# EasyEDA Pro project 双电源电池内阻仪.eprj, board PCB2
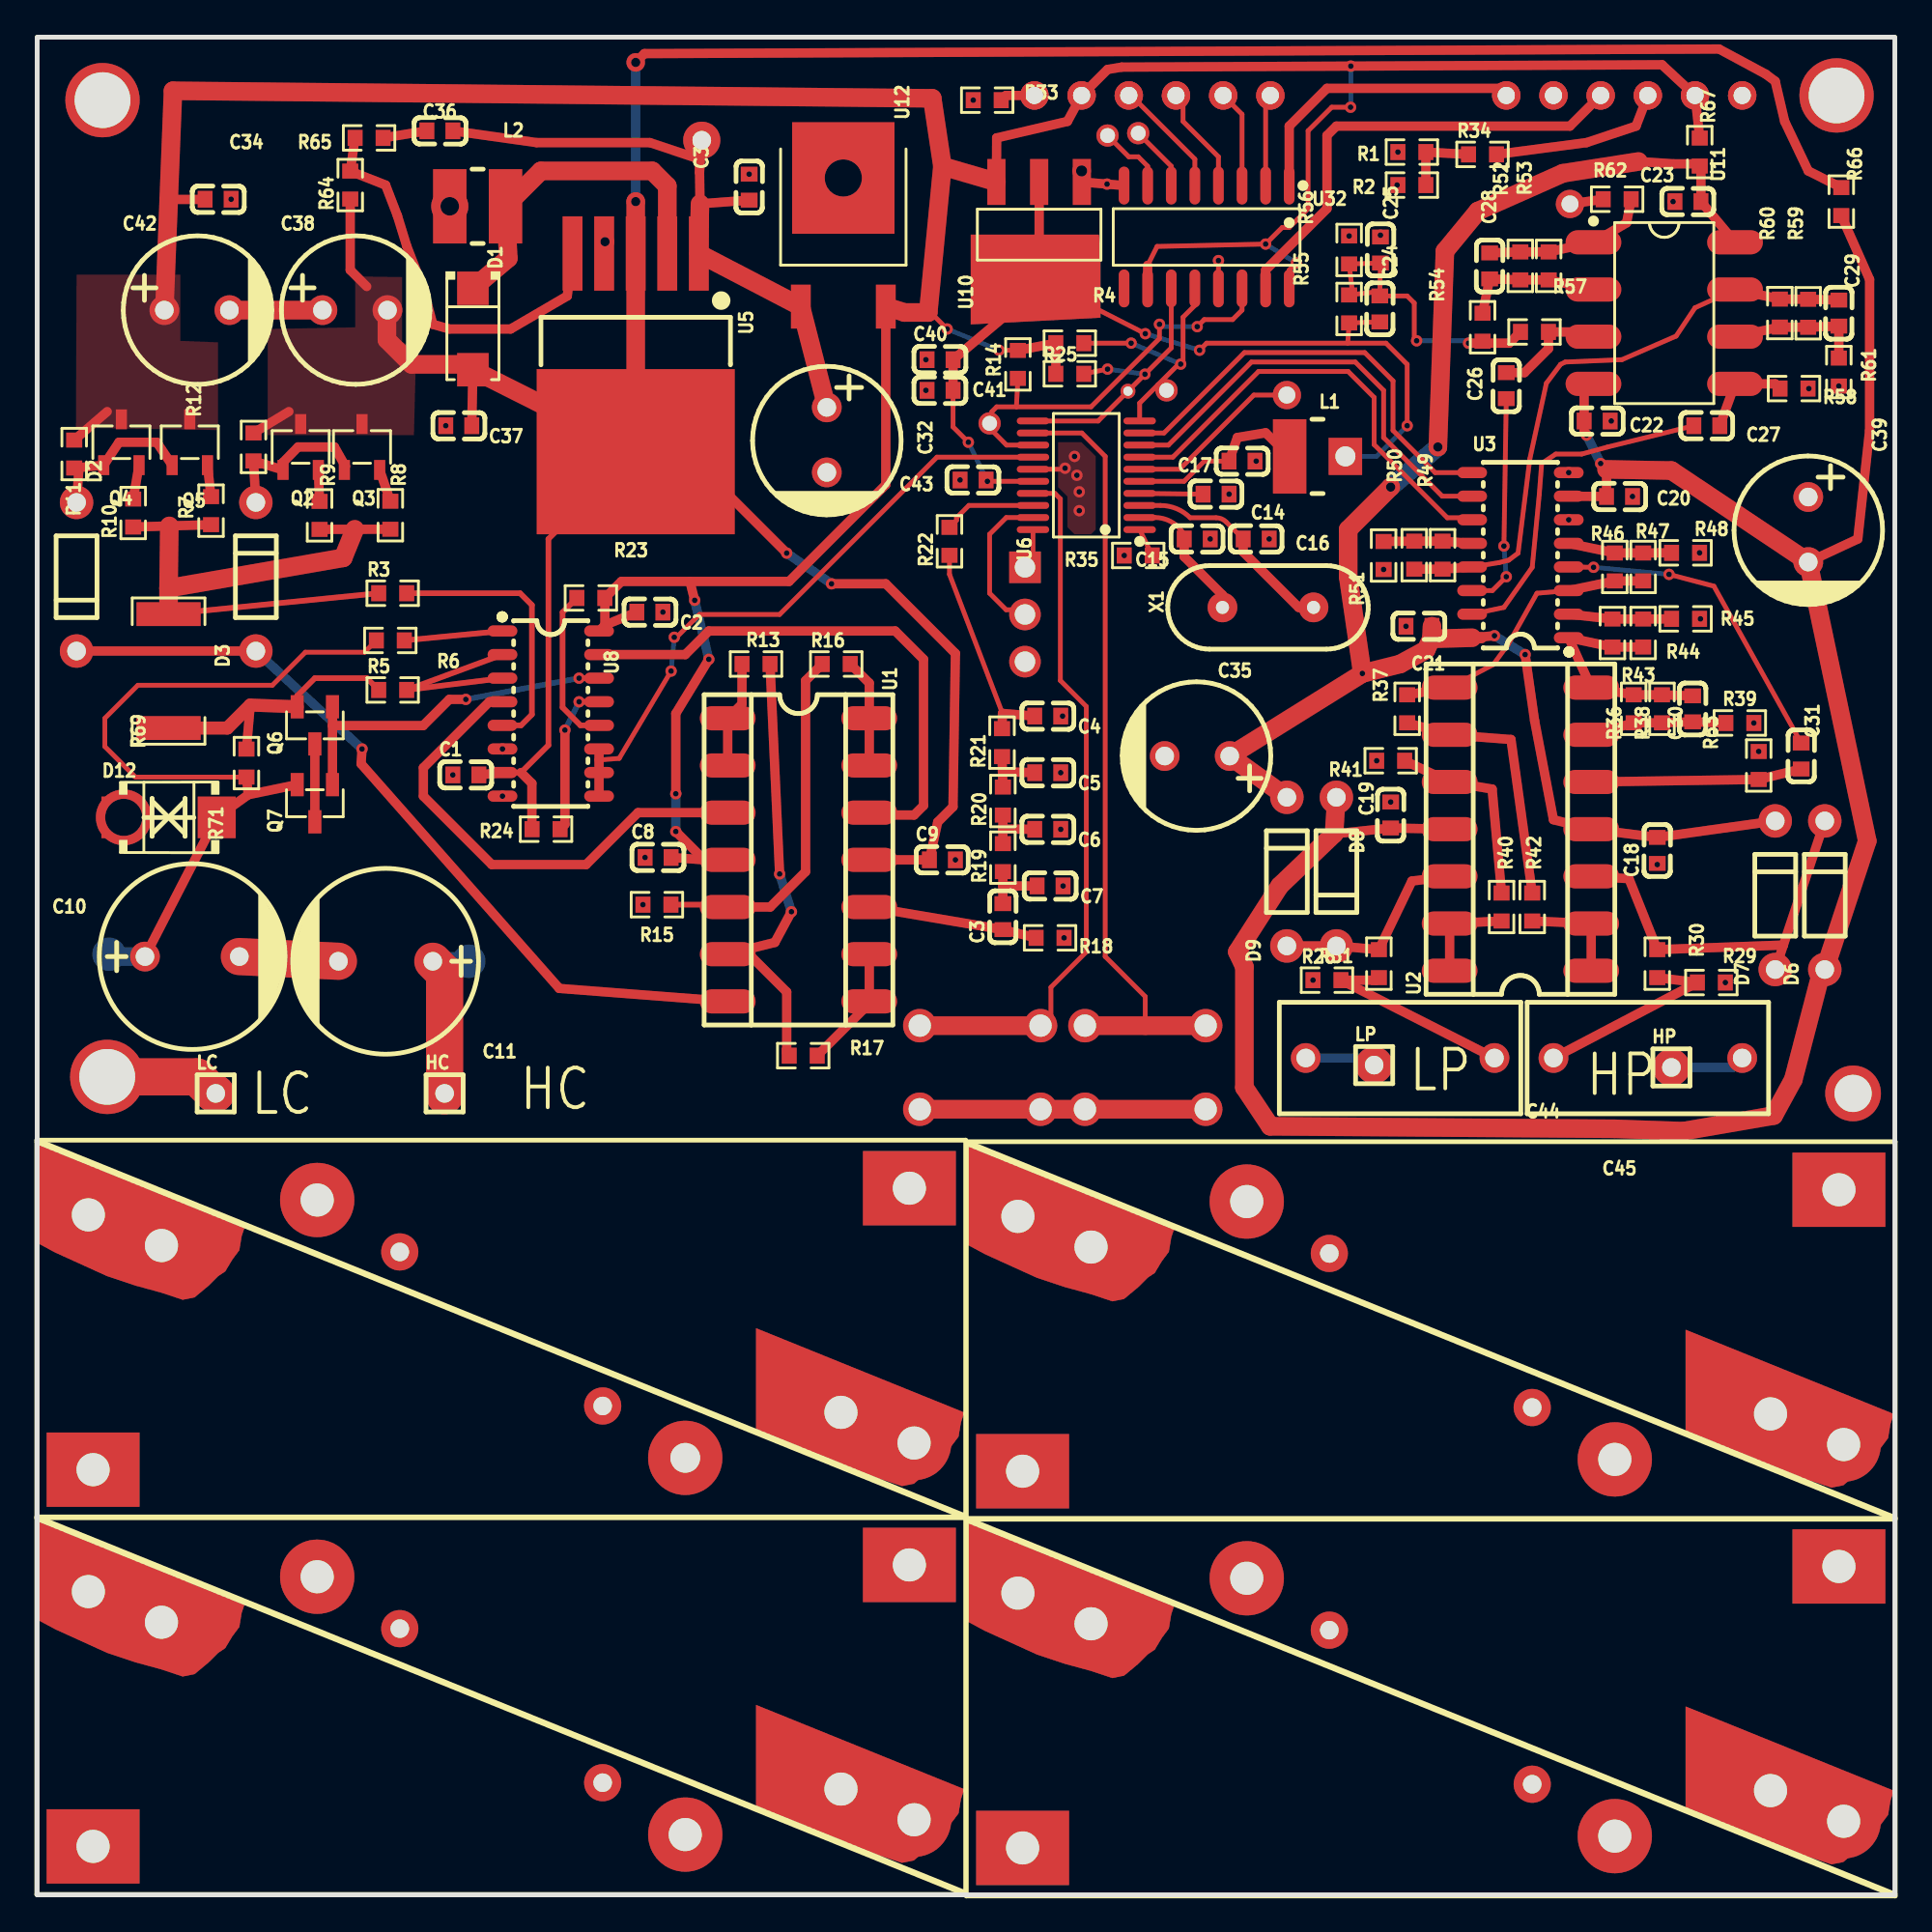
[diagram p1: board, top side]
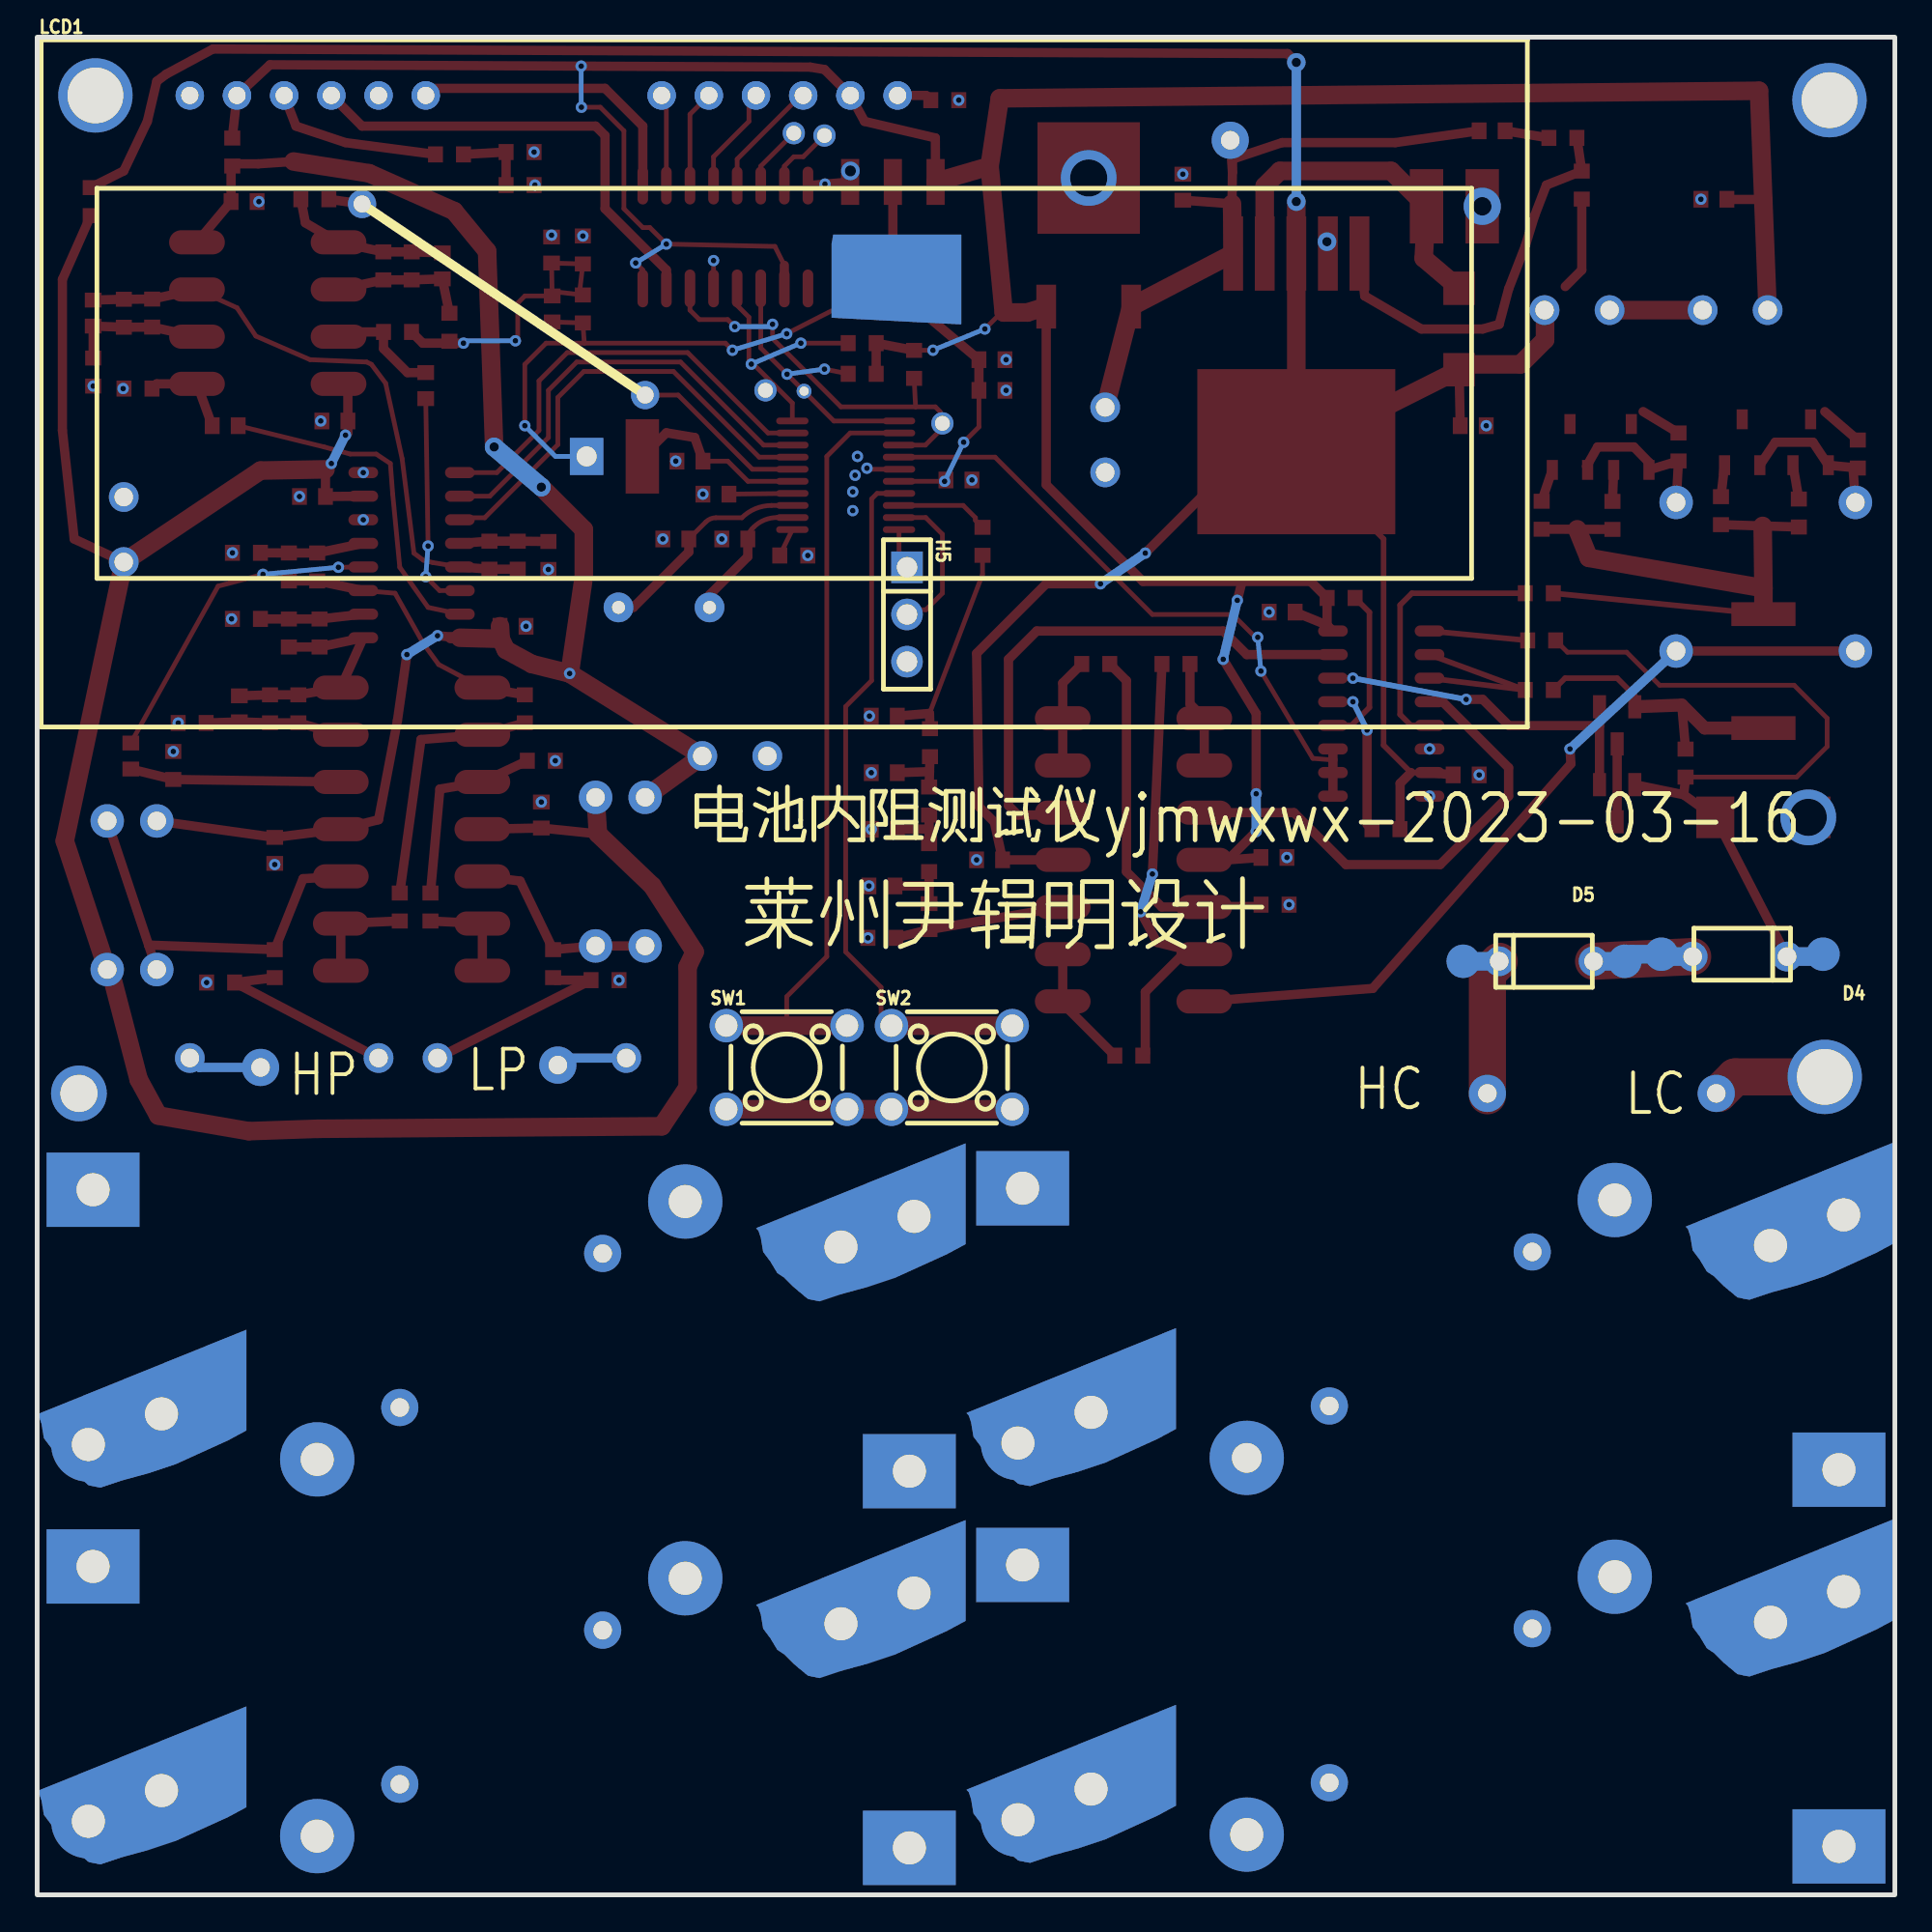
[diagram p2: board, bottom side, seen from below]

Outline 100 x 100 mm; copper layers: Top Layer, Bottom Layer. Coordinates in mm from the lower left corner of the outline.
Outline path: rectangle 0,100 100,0
Stack: Top Layer 0.035mm / Dielectric1 1.51mm FR4 er 4.5 / Bottom Layer 0.035mm

## Design rules (mm)
spacing safeClearance (default): track to track 0.152, other pairs 0.152 to 0.3
track width trackWidth (default): min 0.127, default 0.254, max 2.54
differential pair differentialPair (default): width min 0.127, default 0.254, max 2.54; gap min 0.152, default 0.152
via viaSize (default): diameter min 0.5, default 0.61, max 10; hole min 0.3, default 0.305, max 6

## Placement (name value [footprint] x y rotation side)
C1  100nF  [C0603]  23.08 60.29 0 top
C2  100nF  [C0603]  32.98 69.05 180 top
C3  10uF  [C0603]  51.99 52.66 90 top
C4  1nF  [C0603]  54.4 63.45 180 top
C5  1nF  [C0603]  54.4 60.41 180 top
C6  1nF  [C0603]  54.4 57.36 180 top
C7  500pF  [C0603]  54.53 54.31 180 top
C8  100nF  [C0603]  33.43 55.84 0 top
C9  100nF  [C0603]  48.73 55.72 0 top
C10  47uF  [CAP-TH_BD10.0-P5.00-D1.0-FD]  8.34 50.51 0 top
C11  47uF  [CAP-TH_BD10.0-P5.00-D1.0-FD]  18.76 50.25 180 top
C14  100nF  [C0603]  63.46 75.4 0 top
C15  20pF  [C0603]  62.45 72.99 0 top
C16  20pF  [C0603]  65.62 72.99 0 top
C17  10uF  [C0603]  64.86 77.18 180 top
C18  10uF  [C0603]  87.21 56.22 90 top
C19  10uF  [C0603]  72.86 58.13 90 top
C20  10uF  [C0603]  85.18 75.27 180 top
C21  10uF  [C0603]  74.38 68.29 0 top
C22  10uF  [C0603]  83.97 79.34 180 top
C23  10uF  [C0603]  88.86 91.15 0 top
C24  10uF  [C0603]  72.28 85.37 270 top
C25  10uF  [C0603]  72.31 88.54 270 top
C26  100nF  [C0603]  79.08 81.24 90 top
C27  100nF  [C0603]  89.88 79.08 0 top
C28  1nF  [C0603]  78.19 87.69 90 top
C29  1nF  [C0603]  96.98 85.15 90 top
C30  1nF  [C0603]  89.12 63.84 90 top
C31  100nF  [C0603]  94.96 61.3 270 top
C32  470uF  [CAP-TH_BD8.0-P3.50-D0.6-FD]  42.51 78.32 270 top
C33  100nF  [C0603]  38.33 91.93 270 top
C34  100nF  [C0603]  9.74 91.28 180 top
C35  470uF  [CAP-TH_BD8.0-P3.50-D0.6-FD]  62.45 61.3 180 top
C36  100nF  [C0603]  21.68 94.96 180 top
C37  100nF  [C0603]  22.69 79.08 180 top
C38  470uF  [CAP-TH_BD8.0-P3.50-D0.6-FD]  17.11 85.31 0 top
C39  470uF  [CAP-TH_BD8.0-P3.50-D0.6-FD]  95.34 73.5 270 top
C40  100nF  [C0603]  48.6 82.64 0 top
C41  10uF  [C0603]  48.6 80.99 0 top
C42  470uF  [CAP-TH_BD8.0-P3.50-D0.6-FD]  8.6 85.31 0 top
C43  10uF  [C0603]  50.38 76.16 0 top
C44  100nF  [CAP-TH_L13.0-W6.0-P10.00-D1.0]  73.37 45.05 180 top
C45  100nF  [CAP-TH_L13.0-W6.0-P10.00-D1.0]  86.7 45.05 0 top
D1  1N5819  [SMA_L4.4-W2.6-LS5.0-RD]  23.46 84.29 270 top
D2  1N4148  [DO-35_BD2.0-L4.0-P8.00-D0.5-FD]  2.12 70.95 270 top
D3  1N4148  [DO-35_BD2.0-L4.0-P8.00-D0.5-FD]  11.77 70.95 90 top
D4  -  [DO_1N4007]  8.22 50.64 0 bottom
D5  -  [DO_1N4007]  18.89 50.25 180 bottom
D6  1N4148  [DO-35_BD2.0-L4.0-P8.00-D0.5-FD]  96.23 53.81 90 top
D7  1N4148  [DO-35_BD2.0-L4.0-P8.00-D0.5-FD]  93.56 53.81 90 top
D8  1N4148  [DO-35_BD2.0-L4.0-P8.00-D0.5-FD]  69.94 55.08 270 top
D9  1N4148  [DO-35_BD2.0-L4.0-P8.00-D0.5-FD]  67.27 55.08 90 top
D12  1.0SMBJ5.0CA  [SMB_L4.6-W3.6-LS5.3-BI]  7.07 58 0 top
H5  -  [HDR-TH_3P-P2.54-V-M]  53.18 68.92 270 bottom
HC  -  [HDR-TH_1P-V-M_XKB_X4611WV-01I-C28D40]  21.93 43.14 0 top
HP  -  [HDR-TH_1P-V-M_XKB_X4611WV-01I-C28D40]  87.97 44.54 0 top
L1  47uH  [IND-SMD_L4.5-W4.0_SLF0403#2]  68.92 77.43 0 top
L2  47uH  [IND-SMD_L4.5-W4.0_SLF0403]  23.71 90.89 0 top
LC  -  [HDR-TH_1P-V-M_XKB_X4611WV-01I-C28D40]  9.61 43.14 0 top
LCD1  LCM1602K-FSW-FBW  [MODULE-TH_LCM1602K]  72.73 96.86 180 bottom
LP  -  [HDR-TH_1P-V-M_XKB_X4611WV-01I-C28D40]  71.97 44.67 0 top
NOREF  -  [Pad_e597]  46.95 38.04 0 top
NOREF#2  -  [Pad_e606]  30.44 6.04 20 top
NOREF#3  -  [Pad_e611]  47.21 4.04 160 top
NOREF#4  -  [Pad_e598]  55.66 35.4 0 top
NOREF#5  -  [Pad_e576]  69.56 14.25 200 top
NOREF#6  -  [Pad_e604]  53.05 2.53 180 top
NOREF#7  -  [Pad_e596]  47.21 24.32 160 top
NOREF#8  -  [Pad_e584]  34.89 23.52 180 top
NOREF#9  -  [Pad_e592]  2.76 36.6 340 top
NOREF#10  -  [Pad_e585]  30.44 26.32 20 top
NOREF#11  -  [Pad_e748]  86.7 96.86 0 top
NOREF#12  -  [Pad_e587]  44.34 25.45 180 top
NOREF#13  -  [Pad_e572]  94.38 5.09 180 top
NOREF#14  -  [Pad_e1653]  60.79 80.99 0 top
NOREF#15  -  [Pad_e1447]  82.51 91.02 0 top
NOREF#16  -  [Pad_e730]  58.76 96.86 0 top
NOREF#17  -  [Pad_e1654]  58.72 80.94 0 top
NOREF#18  -  [Pad_e561]  84.93 23.44 180 top
NOREF#19  -  [Pad_e566]  93.31 25.89 160 top
NOREF#20  -  [Pad_e586]  43.27 25.97 160 top
NOREF#21  -  [Pad_e573]  97.24 3.96 160 top
NOREF#22  -  [Pad_e624]  67.27 80.73 0 top
NOREF#23  -  [Pad_e732]  61.3 96.86 0 top
NOREF#24  -  [Pad_e601]  5.62 15.2 0 top
NOREF#25  -  [Pad_e746]  84.16 96.86 0 top
NOREF#26  -  [Pad_e744]  81.62 96.86 0 top
NOREF#27  -  [Pad_e615]  2.76 16.32 340 top
NOREF#28  -  [Pad_e583]  56.73 14.59 340 top
NOREF#29  -  [Pad_e582]  55.66 15.12 0 top
NOREF#30  -  [Pad_e617]  3.01 2.61 180 top
NOREF#31  -  [Pad_e363]  3.52 96.61 0 top
NOREF#32  -  [Pad_e590]  19.52 34.61 200 top
NOREF#33  -  [Pad_e593]  3.01 22.89 180 top
NOREF#34  -  [Pad_e589]  6.69 34.95 340 top
NOREF#35  -  [Pad_e588]  15.08 37.4 0 top
NOREF#36  -  [Pad_e749]  89.24 96.86 0 top
NOREF#37  -  [Pad_e612]  43.27 5.69 160 top
NOREF#38  -  [Pad_e2]  97.75 43.14 0 top
NOREF#39  -  [Pad_e741]  66.38 96.86 0 top
NOREF#40  -  [Pad_e609]  15.08 17.12 0 top
NOREF#41  -  [Pad_e578]  65.11 17.04 0 top
NOREF#42  -  [Pad_e1651]  51.27 79.21 0 top
NOREF#43  -  [Pad_e569]  96.99 37.96 0 top
NOREF#44  -  [Pad_e579]  96.99 17.68 0 top
NOREF#45  -  [Pad_e575]  80.48 5.96 20 top
NOREF#46  -  [Pad_e616]  6.69 14.67 340 top
NOREF#47  -  [Pad_e16]  35.78 94.45 0 top
NOREF#48  -  [Pad_e595]  53.05 22.81 180 top
NOREF#49  -  [Pad_e594]  52.79 16.24 340 top
NOREF#50  -  [Pad_e854]  57.62 94.7 0 top
NOREF#51  -  [Pad_e750]  91.78 96.86 0 top
NOREF#52  -  [Pad_e580]  93.31 5.61 160 top
NOREF#53  -  [Pad_e736]  63.84 96.86 0 top
NOREF#54  -  [Pad_e560]  97.24 24.24 160 top
NOREF#55  -  [Pad_e1]  3.77 44.03 0 top
NOREF#56  -  [Pad_e559]  94.38 25.37 180 top
NOREF#57  -  [Pad_e726]  53.68 96.86 0 top
NOREF#58  -  [Pad_e1670]  53.75 87.04 0 top
NOREF#59  -  [Pad_e600]  56.73 34.87 340 top
NOREF#60  -  [Pad_e562]  80.48 26.23 20 top
NOREF#61  -  [Pad_e574]  84.93 3.16 180 top
NOREF#62  -  [Pad_e564]  69.56 34.53 200 top
NOREF#63  -  [Pad_e728]  56.22 96.86 0 top
NOREF#64  -  [Pad_e613]  44.34 5.17 180 top
NOREF#65  -  [Pad_e607]  19.52 14.33 200 top
NOREF#66  -  [Pad_e605]  34.89 3.24 180 top
NOREF#67  -  [Pad_e742]  79.08 96.86 0 top
NOREF#68  -  [Pad_e599]  52.79 36.52 340 top
NOREF#69  -  [Pad_e557]  5.62 35.48 0 top
NOREF#70  -  [Pad_e610]  46.95 17.76 0 top
NOREF#71  -  [Pad_e855]  59.27 94.83 0 top
NOREF#72  -  [Pad_e365]  96.86 96.86 0 top
NOREF#73  -  [Pad_e568]  65.11 37.32 0 top
Q2  SS8550  [SOT-23-3_L2.9-W1.6-P1.90-LS2.8-BR]  14.19 77.94 270 top
Q3  SS8550  [SOT-23-3_L2.9-W1.6-P1.90-LS2.8-BR]  17.49 77.94 270 top
Q4  SS8050  [SOT-23-3_L2.9-W1.6-P1.90-LS2.8-BR]  4.53 78.19 270 top
Q5  SS8050  [SOT-23-3_L2.9-W1.6-P1.90-LS2.8-BR]  8.22 78.19 270 top
Q6  AO3400A  [SOT-23-3_L2.9-W1.3-P1.90-LS2.4-BR]  14.95 62.95 90 top
Q7  AO3400A  [SOT-23-3_L2.9-W1.3-P1.90-LS2.4-BR]  14.95 58.76 90 top
R1  1K  [R0603]  74 93.81 0 top
R2  1K  [R0603]  74 92.04 0 top
R3  1K  [R0603]  19.14 70.07 0 top
R4  500  [R0603]  55.59 83.53 180 top
R5  1K  [R0603]  19.14 64.86 0 top
R6  1K  [R0603]  19.01 67.53 0 top
R7  1  [R0603]  9.36 74.51 90 top
R8  1  [R0603]  19.01 74.27 270 top
R9  1  [R0603]  15.2 74.26 270 top
R10  1  [R0603]  5.17 74.38 90 top
R11  5K  [R0603]  1.99 77.56 90 top
R12  5K  [R0603]  11.65 77.94 270 top
R13  10K  [R0603]  38.7 66.26 180 top
R14  500  [R0603]  52.79 82.39 90 top
R15  10K  [R0603]  33.36 53.3 0 top
R16  10K  [R0603]  43.01 66.26 0 top
R17  10K  [R0603]  41.24 45.17 180 top
R18  1M  [R0603]  54.53 51.52 180 top
R19  10K  [R0603]  51.99 55.83 90 top
R20  10K  [R0603]  51.99 58.88 90 top
R21  10K  [R0603]  51.94 62.02 90 top
R22  10K  [R0603]  49.11 72.86 90 top
R23  1K  [R0603]  29.81 69.81 180 top
R24  1K  [R0603]  27.39 57.37 0 top
R25  500  [R0603]  55.59 81.88 180 top
R28  100K  [R0603]  69.43 49.24 0 top
R29  100K  [R0603]  90.12 49.11 180 top
R30  1K  [R0603]  87.21 50.13 90 top
R31  1K  [R0603]  72.22 50.13 90 top
R33  1K  [R0603]  51.14 96.61 180 top
R34  1K  [R0603]  77.8 93.69 0 top
R35  10K  [R0603]  59.27 72.1 180 top
R36  10K  [R0603]  85.94 63.84 270 top
R37  10K  [R0603]  73.75 63.84 90 top
R38  100K  [R0603]  87.47 63.84 90 top
R39  1K  [R0603]  91.66 63.08 180 top
R40  10K  [R0603]  78.83 53.17 270 top
R41  10K  [R0603]  72.86 61.05 0 top
R42  10K  [R0603]  80.48 53.17 90 top
R43  1K  [R0603]  84.8 67.92 270 top
R44  10K  [R0603]  86.45 67.92 270 top
R45  100  [R0603]  88.74 68.69 180 top
R46  1K  [R0603]  84.93 71.48 270 top
R47  10K  [R0603]  86.45 71.48 270 top
R48  100  [R0603]  88.74 72.24 180 top
R49  1K  [R0603]  74.13 72.11 270 top
R50  10K  [R0603]  75.65 72.11 270 top
R51  100  [R0603]  72.48 72.1 90 top
R52  10K  [R0603]  79.84 87.69 90 top
R53  100K  [R0603]  81.36 87.69 270 top
R54  1K  [R0603]  77.81 84.39 270 top
R55  1K  [R0603]  70.62 85.37 270 top
R56  1K  [R0603]  70.62 88.54 270 top
R57  10K  [R0603]  80.6 84.13 180 top
R58  10K  [R0603]  94.57 81.08 180 top
R59  10K  [R0603]  95.33 85.14 90 top
R60  100K  [R0603]  93.81 85.15 270 top
R61  1K  [R0603]  96.98 81.97 90 top
R62  100  [R0603]  85.05 91.28 180 top
R63  10K  [R0603]  92.67 60.8 270 top
R64  100K  [R0603]  16.85 92.04 90 top
R65  100K  [R0603]  17.87 94.58 180 top
R66  10  [R0603]  97.12 91.15 270 top
R67  10  [R0603]  89.5 93.81 270 top
R69  10Ω  [R2512]  7.07 65.88 90 top
R71  100Ω  [R0603]  11.27 60.92 90 top
SW1  1TS005A-2600-5001  [SW-TH_4P-L6.0-W6.0-P4.50-LS6.5]  59.65 44.54 180 bottom
SW2  1TS005A-2600-5001  [SW-TH_4P-L6.0-W6.0-P4.50-LS6.5]  50.76 44.54 180 bottom
U1  TL084CN  [DIP-14_L17.8-W10.2-P2.54-BL]  40.98 55.72 270 top
U2  TL084CN  [DIP-14_L17.8-W10.2-P2.54-BL]  79.84 57.37 90 top
U3  CD4053BM/TR  [SOP-16_L9.9-W3.9-P1.27-LS6.1-BL]  79.84 72.11 90 top
U5  XL2596S-5.0E1  [TO-263-5_L10.2-W9.9-P1.70-LS14.4-TL]  32.22 83.02 270 top
U6  STM32F030F4P6  [TSSOP-20_L6.5-W4.4-P0.65-LS6.4-BL]  56.48 76.42 90 top
U8  CD4053BM/TR  [SOP-16_L9.9-W3.9-P1.27-LS6.1-BL]  27.65 63.59 270 top
U10  AMS1117-3.3  [SOT-223-4_L6.5-W3.5-P2.30-LS7.0-BR]  53.94 89.37 90 top
U11  NE5532P  [DIP-8_L9.4-W6.4-P2.54-LS9.1-BL]  87.59 85.15 270 top
U12  CJ7805 3%  [TO-252-2_L6.6-W6.1-P4.58-LS10.1-BR-CW]  43.4 88.96 270 top
U32  74HC595D.  [SOP-16_L9.9-W3.9-P1.27-LS6.0-BL]  62.95 89.24 180 top
X1  8MHz  [OSC-TH_L10.0-W4.5-P5.00]  66.26 69.3 90 top

## Footprints (pads in the part's own frame, mm; a bottom-side part is the same pattern mirrored in y, then rotated)
C0603
  rect 0.8x0.9 smd: 1(-0.7,0) 2(0.7,0)
CAP-TH_BD8.0-P3.50-D0.6-FD
  round 1.6 hole 1: 1(-1.75,0) 2(1.75,0)
CAP-TH_BD10.0-P5.00-D1.0-FD
  round 1.6 hole 1: 1(-2.54,0) 2(2.54,0)
CAP-TH_L13.0-W6.0-P10.00-D1.0
  round 1.6 hole 1: 1(-5.08,0) 2(5.08,0)
DIP-8_L9.4-W6.4-P2.54-LS9.1-BL
  oval 1.3x3 smd: 1(-3.81,-3.81) 2(-1.27,-3.81) 3(1.27,-3.81) 4(3.81,-3.81) 5(3.81,3.81) 6(1.27,3.81) 7(-1.27,3.81) 8(-3.81,3.81)
DIP-14_L17.8-W10.2-P2.54-BL
  oval 1.3x3 smd: 1(-7.62,-3.81) 2(-5.08,-3.81) 3(-2.54,-3.81) 4(0,-3.81) 5(2.54,-3.81) 6(5.08,-3.81) 7(7.62,-3.81) 8(7.62,3.81) 9(5.08,3.81) 10(2.54,3.81) 11(0,3.81) 12(-2.54,3.81) 13(-5.08,3.81) 14(-7.62,3.81)
DO-35_BD2.0-L4.0-P8.00-D0.5-FD
  round 1.8 hole 1: 1(-4,0) 2(4,0)
DO_1N4007
  round 1.8 smd: 1(-4.35,0) 2(4.35,0)
HDR-TH_1P-V-M_XKB_X4611WV-01I-C28D40
  round 2 hole 1: 1(0,0)
HDR-TH_3P-P2.54-V-M
  rect 1.7x1.7 hole 1.1: 1(-2.54,0)
  round 1.7 hole 1.1: 2(0,0) 3(2.54,0)
IND-SMD_L4.5-W4.0_SLF0403
  rect 1.8x4 smd: 1(-1.5,0) 2(1.5,0)
IND-SMD_L4.5-W4.0_SLF0403#2
  rect 1.8x4 smd: 1(-1.5,0)
  rect 1.8x2 hole 1.08: 2(1.5,0)
MODULE-TH_LCM1602K
  round 1.524 hole 0.914: 1(-19.05,0) 2(-16.51,0) 3(-13.97,0) 4(-11.43,0) 5(-8.89,0) 6(-6.35,0) 11(6.35,0) 12(8.89,0) 13(11.43,0) 14(13.97,0) 15(16.51,0) 16(19.05,0)
OSC-TH_L10.0-W4.5-P5.00
  round 1.6 hole 0.7: 1(0,2.45) 2(0,-2.45)
Pad_e1
  round 4 hole 3: 1(0,0)
Pad_e2
  round 3 hole 2: 1(0,0)
Pad_e16
  round 2 hole 1: 1(0,0)
Pad_e363
  round 4 hole 3: 1(0,0)
Pad_e365
  round 4 hole 3: 1(0,0)
Pad_e557
  custom 11.284x8.504 hole 0.005: 1(0,0)
Pad_e559
  custom 11.284x8.504 hole 0.005: 1(0,0)
Pad_e560
  oval 4x4 hole 1.78: 1(0,0)
Pad_e561
  round 4 hole 1.78: 1(0,0)
Pad_e562
  round 2 hole 1: 1(0,0)
Pad_e564
  round 2 hole 1: 1(0,0)
Pad_e566
  oval 4x4 hole 1.78: 1(0,0)
Pad_e568
  round 4 hole 1.78: 1(0,0)
Pad_e569
  rect 5x4 hole 1.78: 1(0,0)
Pad_e572
  custom 11.284x8.504 hole 0.005: 1(0,0)
Pad_e573
  oval 4x4 hole 1.78: 1(0,0)
Pad_e574
  round 4 hole 1.78: 1(0,0)
Pad_e575
  round 2 hole 1: 1(0,0)
Pad_e576
  round 2 hole 1: 1(0,0)
Pad_e578
  round 4 hole 1.78: 1(0,0)
Pad_e579
  rect 5x4 hole 1.78: 1(0,0)
Pad_e580
  oval 4x4 hole 1.78: 1(0,0)
Pad_e582
  custom 11.284x8.504 hole 0.005: 1(0,0)
Pad_e583
  oval 4x4 hole 1.78: 1(0,0)
Pad_e584
  round 4 hole 1.6: 1(0,0)
Pad_e585
  round 2 hole 1: 1(0,0)
Pad_e586
  oval 4x4 hole 1.78: 1(0,0)
Pad_e587
  custom 11.284x8.504 hole 0.005: 1(0,0)
Pad_e588
  round 4 hole 1.78: 1(0,0)
Pad_e589
  oval 4x4 hole 1.78: 1(0,0)
Pad_e590
  round 2 hole 1: 1(0,0)
Pad_e592
  oval 4x4 hole 1.78: 1(0,0)
Pad_e593
  rect 5x4 hole 1.78: 1(0,0)
Pad_e594
  oval 4x4 hole 1.78: 1(0,0)
Pad_e595
  rect 5x4 hole 1.78: 1(0,0)
Pad_e596
  oval 4x4 hole 1.78: 1(0,0)
Pad_e597
  rect 5x4 hole 1.78: 1(0,0)
Pad_e598
  custom 11.284x8.504 hole 0.005: 1(0,0)
Pad_e599
  oval 4x4 hole 1.78: 1(0,0)
Pad_e600
  oval 4x4 hole 1.78: 1(0,0)
Pad_e601
  custom 11.284x8.504 hole 0.005: 1(0,0)
Pad_e604
  rect 5x4 hole 1.78: 1(0,0)
Pad_e605
  round 4 hole 1.78: 1(0,0)
Pad_e606
  round 2 hole 1: 1(0,0)
Pad_e607
  round 2 hole 1: 1(0,0)
Pad_e609
  round 4 hole 1.78: 1(0,0)
Pad_e610
  rect 5x4 hole 1.78: 1(0,0)
Pad_e611
  oval 4x4 hole 1.78: 1(0,0)
Pad_e612
  oval 4x4 hole 1.78: 1(0,0)
Pad_e613
  custom 11.284x8.504 hole 0.005: 1(0,0)
Pad_e615
  oval 4x4 hole 1.78: 1(0,0)
Pad_e616
  oval 4x4 hole 1.78: 1(0,0)
Pad_e617
  rect 5x4 hole 1.78: 1(0,0)
Pad_e624
  round 1.524 hole 0.914: 1(0,0)
Pad_e726
  round 1.524 hole 0.914: 2(0,0)
Pad_e728
  round 1.524 hole 0.914: 3(0,0)
Pad_e730
  round 1.524 hole 0.914: 4(0,0)
Pad_e732
  round 1.524 hole 0.914: 5(0,0)
Pad_e736
  round 1.524 hole 0.914: 6(0,0)
Pad_e741
  round 1.524 hole 0.914: 7(0,0)
Pad_e742
  round 1.524 hole 0.914: 8(0,0)
Pad_e744
  round 1.524 hole 0.914: 9(0,0)
Pad_e746
  round 1.524 hole 0.914: 10(0,0)
Pad_e748
  round 1.524 hole 0.914: 11(0,0)
Pad_e749
  round 1.524 hole 0.914: 12(0,0)
Pad_e750
  round 1.524 hole 0.914: 13(0,0)
Pad_e854
  round 1.2 hole 0.8: 1(0,0)
Pad_e855
  round 1.2 hole 0.8: 14(0,0)
Pad_e1447
  round 1.524 hole 0.914: 1(0,0)
Pad_e1651
  round 1.2 hole 0.8: 1(0,0)
Pad_e1653
  round 1.2 hole 0.8: 15(0,0)
Pad_e1654
  round 0.8 hole 0.5: 16(0,0)
Pad_e1670
  custom 6.985x4.832 hole 2.791: 17(0,0)
R0603
  rect 0.806x0.864 smd: 1(-0.753,0) 2(0.753,0)
R2512
  rect 1.282x3.456 smd: 1(-3.067,0) 2(3.067,0)
SMA_L4.4-W2.6-LS5.0-RD
  rect 1.8x1.7 smd: 1(-2.192,0) 2(2.192,0)
SMB_L4.6-W3.6-LS5.3-BI
  rect 2.047x2.241 smd: 1(-2.591,0) 2(2.591,0)
SOP-16_L9.9-W3.9-P1.27-LS6.0-BL
  oval 0.574x2.038 smd: 1(-4.445,-2.769) 2(-3.175,-2.769) 3(-1.905,-2.769) 4(-0.635,-2.769) 5(0.635,-2.769) 6(1.905,-2.769) 7(3.175,-2.769) 8(4.445,-2.769) 9(4.445,2.769) 10(3.175,2.769) 11(1.905,2.769) 12(0.635,2.769) 13(-0.635,2.769) 14(-1.905,2.769) 15(-3.175,2.769) 16(-4.445,2.769)
SOP-16_L9.9-W3.9-P1.27-LS6.1-BL
  oval 0.6x1.6 smd: 1(-4.445,-2.6) 2(-3.175,-2.6) 3(-1.905,-2.6) 4(-0.635,-2.6) 5(0.635,-2.6) 6(1.905,-2.6) 7(3.175,-2.6) 8(4.445,-2.6) 9(4.445,2.6) 10(3.175,2.6) 11(1.905,2.6) 12(0.635,2.6) 13(-0.635,2.6) 14(-1.905,2.6) 15(-3.175,2.6) 16(-4.445,2.6)
SOT-23-3_L2.9-W1.3-P1.90-LS2.4-BR
  rect 1.25x0.7 smd: 1(1,-0.95) 2(1,0.95) 3(-1,0)
SOT-23-3_L2.9-W1.6-P1.90-LS2.8-BR
  rect 1.07x0.6 smd: 1(1.235,-0.95) 2(1.235,0.95) 3(-1.235,0)
SOT-223-4_L6.5-W3.5-P2.30-LS7.0-BR
  rect 2.47x0.98 smd: 1(2.835,-2.3) 2(2.835,0) 3(2.835,2.3)
  rect 2.47x3.6 smd: 4(-2.835,0)
SW-TH_4P-L6.0-W6.0-P4.50-LS6.5
  round 1.8 hole 1.2: 1(-3.25,2.25) 2(3.25,2.25) 3(-3.25,-2.25) 4(3.25,-2.25)
TO-252-2_L6.6-W6.1-P4.58-LS10.1-BR-CW
  rect 2.364x1.064 smd: 1(3.462,-2.286) 3(3.462,2.286)
  rect 6.004x5.512 smd: 2(-3.462,0)
TO-263-5_L10.2-W9.9-P1.70-LS14.4-TL
  rect 4x1.069 smd: 1(-5.334,3.4) 2(-5.334,1.7) 3(-5.334,0) 4(-5.334,-1.7) 5(-5.334,-3.4)
  rect 8.89x10.66 smd: 6(5.334,0)
TSSOP-20_L6.5-W4.4-P0.65-LS6.4-BL
  oval 0.364x1.742 smd: 1(-2.925,-2.871) 2(-2.275,-2.871) 3(-1.625,-2.871) 4(-0.975,-2.871) 5(-0.325,-2.871) 6(0.325,-2.871) 7(0.975,-2.871) 8(1.625,-2.871) 9(2.275,-2.871) 10(2.925,-2.871) 11(2.925,2.871) 12(2.275,2.871) 13(1.625,2.871) 14(0.975,2.871) 15(0.325,2.871) 16(-0.325,2.871) 17(-0.975,2.871) 18(-1.625,2.871) 19(-2.275,2.871) 20(-2.925,2.871)

## Nets
As in the schematic, except:
+3.3V: C24.2 C40.2 C41.2 C43.2 L1.2 NOREF#58.17 R55.2 U6.16 U10.2 U10.4
+5V-D: C2.2 C8.2 C34.2 C42.1 LCD1.2 LCD1.15 NOREF#36.12 NOREF#63.3 Q4.3 Q5.3 R4.2 R11.2 R14.2 R23.1 R25.2 R67.1 U1.4 U8.16 U10.3 U12.3 U32.10 U32.16
GND: C1.1 C2.1 C4.1 C5.1 C6.1 C7.1 C8.1 C9.2 C14.2 C15.2 C16.2 C17.1 C18.1 C19.2 C20.1 C21.1 C22.1 C23.1 C25.1 C32.2 C33.1 C34.1 C35.2 C37.2 C38.1 C39.1 C40.1 C41.1 C42.2 C43.1 D12.1 H5.3 L2.1 LC.1 LCD1.1 LCD1.5 NOREF.1 NOREF#2.1 NOREF#5.1 NOREF#6.1 NOREF#8.1 NOREF#10.1 NOREF#18.1 NOREF#26.9 NOREF#30.1 NOREF#31.1 NOREF#32.1 NOREF#33.1 NOREF#35.1 NOREF#38.1 NOREF#40.1 NOREF#41.1 NOREF#43.1 NOREF#44.1 NOREF#45.1 NOREF#48.1 NOREF#51.13 NOREF#55.1 NOREF#60.1 NOREF#61.1 NOREF#62.1 NOREF#65.1 NOREF#66.1 NOREF#70.1 NOREF#72.1 NOREF#73.1 R1.1 R2.1 R15.1 R18.1 R28.1 R29.1 R33.2 R35.2 R39.1 R41.1 R45.1 R48.1 R51.1 R56.1 R58.1 R61.1 R63.1 SW1.3 SW1.4 SW2.3 SW2.4 U3.6 U3.8 U5.4 U6.15 U8.6 U8.8 U10.1 U12.2 U32.8 U32.13
+9: C32.1 C33.2 C36.1 NOREF#47.1 U5.1 U12.1
PA0_ADC: NOREF#15.1 NOREF#22.1 R62.2 U6.6
PA4_SPI1_NSS_HC595_12_RCK: NOREF#14.15 R4.1 U6.10 U32.12
PA5_SPI1_SCK_HC595_11_SCK: NOREF#17.16 R25.1 U6.11 U32.11
PA7_SPI1_MOSI_HC595_14_SER: NOREF#42.1 R14.1 U6.13 U32.14
$1N32014: LCD1.16 NOREF#57.2 R33.1
$1N33242: LCD1.11 NOREF#39.7 U32.2
$1N33289: LCD1.12 NOREF#53.6 U32.3
$1N33336: LCD1.13 NOREF#23.5 U32.4
$1N33383: LCD1.14 NOREF#16.4 U32.5
$1N33961: LCD1.6 NOREF#67.8 U32.1
$1N34010: LCD1.4 NOREF#25.10 U32.15
$1N34377: LCD1.3 NOREF#11.11 R34.2

Pads without a net: NOREF#3 1; NOREF#4 1; NOREF#7 1; NOREF#9 1; NOREF#12 1; NOREF#13 1; NOREF#19 1; NOREF#20 1; NOREF#21 1; NOREF#24 1; NOREF#27 1; NOREF#28 1; NOREF#29 1; NOREF#34 1; NOREF#37 1; NOREF#46 1; NOREF#49 1; NOREF#50 1; NOREF#52 1; NOREF#54 1; NOREF#56 1; NOREF#59 1; NOREF#64 1; NOREF#68 1; NOREF#69 1; NOREF#71 14; U32 6 7 9

## Via types
v1: diameter 0.61, hole 0.305, Top Layer to Bottom Layer, 96 vias
v2: diameter 1, hole 0.5, Top Layer to Bottom Layer, 5 vias
v3: diameter 3, hole 2, Top Layer to Bottom Layer, 2 vias
v4: diameter 1, hole 0.6, Top Layer to Bottom Layer, 1 via
v5: diameter 2, hole 1, Top Layer to Bottom Layer, 1 via

## Routing (per net, layer and track width the routed paths; a pad name or vN(x,y) marks a point on that pad's centre or on a via; arc(x,y) is an arc through that point)
+3.3V: length 51.4
  Top Layer w0.254: 70.55,83.53 72.61,83.53 73.75,82.39 v1(73.75,79.08) ; 70.55,83.53 R55.2 C24.2 ; 70.55,83.53 62.95,83.53 v1(62.57,83.15) ; v1(59.65,84.04) NOREF#58.17 ; C43.2 v1(51.15,76.09) U6.16 ; v1(50.13,78.19) 49.3,79.02 C41.2
  Top Layer w0.5: C41.2 C40.2 U10.4 ; U10.2 53.94,88.1
  Bottom Layer w0.254: v1(73.75,79.08) 72.1,77.43 L1.2 ; v1(62.57,83.15) v1(59.65,84.04) ; v1(50.13,78.19) v1(51.15,76.09)
+5V: length 88.6
  Top Layer w0.5: v1(80.1,66.76) 80.61,63.21 81.62,57.87 U2.4 C18.2 D7.2 ; v1(78.45,67.78) U3.16 ; 86.19,93.31 88.1,93.18 89.24,93.18 89.56,92.86 C23.2 91.4,88.96
  Top Layer w1: 75.05,67.61 C21.2 ; 75.05,67.61 74.76,67.02 73.37,66.26 v1(71.34,65.75) ; 75.05,67.61 U3.16 ; v1(71.34,65.75) C35.1 D9.2 ; v1(71.34,65.75) 70.57,70.95 70.57,73.5 v2(72.86,75.78) ; 86.19,93.31 82.13,92.67 77.56,90.64 75.78,88.48 v2(75.4,77.94)
  Bottom Layer w0.5: v1(80.1,66.76) v1(78.45,67.78)
  Bottom Layer w1: v2(72.86,75.78) v2(75.4,77.94)
+5V-D: length 201.7
  Top Layer w0.254: v1(70.7,96.23) 69.69,96.23 68.41,94.96 68.41,90.77 67.4,89.75 67.02,89.75 v1(66.13,88.86) 60.29,88.73 59.78,87.72 ; v1(51.78,83.15) 52.79,83.15 R14.2 ; U32.16 67.4,87.47 v1(67.78,87.85) ; v1(48.98,84.29) 48.09,85.18
  Top Layer w0.5: 30.56,68.35 C2.2 ; 30.56,68.35 U8.16 ; 30.56,68.35 R23.1 31.45,70.7 35.14,70.7 ; C8.2 35.9,55.72 ; 35.9,55.72 U1.4 ; 35.9,55.72 v1(34.38,57.24) ; U32.10 59.78,87.72 ; v1(36.16,66.51) 34.38,63.59 v1(34.38,59.27) ; U10.3 51.65,94.58 55.46,95.47 NOREF#63.3 57.62,98.26 58.38,98.39 v1(70.72,98.44) 87.47,98.51 NOREF#36.12 R67.1 ; R14.2 R4.2 R25.2 ; 7.08,91.26 9.03,91.26 C34.2 ; v1(35.4,69.69) 35.14,70.7 ; 35.14,70.7 40.47,70.7 45.68,75.91 U12.3 ; R11.2 3.77,79.84
  Top Layer w1: 48.73,93.05 U10.3 ; 48.73,93.05 47.97,85.18 46.7,85.18 U12.3 ; 48.73,93.05 48.18,96.71 7.31,97.11 7.08,91.26 C42.1
  Bottom Layer w0.254: v1(67.78,87.85) v1(66.13,88.86) ; v1(51.78,83.15) v1(48.98,84.29) ; v1(70.7,96.23) 70.72,96.24 v1(70.72,98.44)
  Bottom Layer w0.5: v1(35.4,69.69) v1(36.16,66.51) ; v1(34.38,59.27) v1(34.38,57.24)
-5V: length 126.3
  Top Layer w0.5: v1(83.4,78.58) 83.27,78.7 C22.2 83.27,80.83 U11.4 ; C39.2 98.01,72.99 98.64,78.83 98.64,86.96 R66.2 ; 69.81,57.11 C19.1 U2.11 ; v1(84.16,77.05) 84.48,76.73 C20.2 U3.7
  Top Layer w1: 84.48,76.73 87.97,76.67 C39.2 98.51,56.73 D6.1 95.99,49.47 94.53,43.89 93.48,41.95 88.61,41.11 84.93,41.24 66.38,41.37 64.99,43.46 64.99,49.95 64.6,50.76 66.89,54.32 69.81,57.11 D8.1
  Bottom Layer w0.5: v1(84.16,77.05) v1(83.4,78.58)
-5V-D: length 178.8
  Top Layer w0.3: U5.6 27.52,72.99 27.52,61.89 26.05,60.41 U8.7
  Top Layer w0.5: U1.11 C9.1 48.48,57.75 49.3,58.57 49.43,66.83 45.68,70.57 v1(42.76,70.57) ; R64.1 16.85,87.47 17.74,86.58 ; R24.1 26.63,57.37 26.63,59.83 26.05,60.41 ; C1.2 U8.7 ; R12.1 13.55,79.84 ; C37.1 D1.2 ; v2(32.22,98.64) 32.69,99.11 90.54,99.36 93.05,98.01 93.56,97.62 94.07,95.47 95.34,92.8 R66.1 ; U5.6 34.89,77.69 v1(40.35,72.22)
  Top Layer w1: v2(32.22,91.15) U5.3 U5.6 D1.2 23.17,82.39 20.16,82.39 18.83,83.71 18.83,85.31
  Bottom Layer w0.5: v2(32.22,91.15) v2(32.22,98.64) ; v1(42.76,70.57) v1(40.35,72.22)
GND: length 32.1
  Top Layer w0.254: U6.15 55.28,76.74 v1(55.33,76.8) ; U32.13 v1(63.59,87.97)
  Top Layer w0.5: 56.24,92.2 v1(57.59,92.09) U32.8
  Top Layer w1: SW2.4 SW2.3 SW1.4 SW1.3 ; C42.2 15.33,85.31
  Top Layer w2: LC.1 9.49,43.14 8.6,44.03 NOREF#55.1
  vias: v1(10.44,91.28) v1(22,79.08) v1(22.38,60.29) v1(25.05,61.68) v1(25.05,59.14) v1(32.61,53.3) v1(32.72,55.84) v1(33.68,69.05) v1(38.33,92.63) v1(47.84,82.64) v1(47.84,80.99) v1(49.43,55.72) v1(49.68,76.16) v1(50.39,96.61) v1(55.1,60.41) v1(55.1,57.36) v1(55.2,63.45) v1(55.23,54.31) v1(55.28,51.52) v1(55.84,77.43) v1(55.97,76.42) v1(56.1,75.53) v1(56.1,74.51) v1(58.52,72.1) v1(63.15,72.99) v1(64.16,75.4) v1(65.62,77.18) v1(66.32,72.99) v1(68.68,49.24) v1(70.62,89.3) v1(72.11,61.05) v1(72.31,89.34) v1(72.48,71.34) v1(72.86,58.83) v1(73.25,93.81) v1(73.2,92.04) v1(73.68,68.29) v1(82.44,76.56) v1(82.44,74.02) v1(84.74,79.34) v1(85.88,75.27) v1(87.21,55.46) v1(88.06,91.15) v1(89.49,72.24) v1(89.53,68.69) v1(90.88,49.11) v1(92.41,63.08) v1(92.67,61.55) v1(95.37,81.08) v1(96.98,81.22) v2(30.57,88.99) v3(4.66,58) v3(43.4,92.42) v4(56.22,92.8) v5(22.21,90.89)
(no net): length 7.4
  Top Layer w0.254: U32.7 59.78,93.05 59.27,93.56 58.76,93.56 NOREF#50.1 ; NOREF#71.14 61.05,93.05 U32.6
+9: length 34.7
  Top Layer w0.5: 35.66,92.73 NOREF#47.1 ; 35.66,92.73 35.65,93.43 32.98,94.32 26.89,94.32 C36.1 ; 35.66,92.73 35.68,91.03 C33.2
  Top Layer w1: 35.68,91.03 U5.1 U12.1 C32.1
PA0_ADC: length 11.4
  Top Layer w0.254: U6.6 61.5,76.74 65.49,80.73 NOREF#22.1
  Top Layer w0.5: R62.2 NOREF#15.1
PA1_4053_11_SA_10X: length 24.6
  Top Layer w0.254: 59.35,77.39 61.13,77.39 65.75,82 70.57,82 71.97,80.61 71.97,78.07 75.91,74.13 77.13,74.13 U3.11
PA2_4053_10_SB_10X: length 24.2
  Top Layer w0.254: U6.8 60.9,78.04 65.37,82.51 70.96,82.51 72.48,80.99 72.48,78.45 75.64,75.29 U3.10
PA3_4053_9_SC_10X: length 23.9
  Top Layer w0.254: U6.9 60.66,78.69 64.99,83.02 71.46,83.02 72.99,81.5 72.99,78.83 75.26,76.56 U3.9
PA4_SPI1_NSS_HC595_12_RCK: length 14.6
  Top Layer w0.254: U6.10 59.35,80.3 60.34,81.3 ; 60.34,81.3 61.44,82.4 v1(61.56,82.4) 61.68,82.53 61.68,84.92 62.32,85.56 U32.12 ; 60.34,81.3 60.92,80.86 ; R4.1 v1(58.89,83.53)
  Bottom Layer w0.254: v1(58.89,83.53) v1(61.56,82.4)
PA5_SPI1_SCK_HC595_11_SCK: length 15.6
  Top Layer w0.254: U32.11 61.05,83.27 v1(59.63,81.86) NOREF#17.16 57.11,79.34 53.61,79.34 U6.11 ; R25.1 v1(57.62,82.13)
  Bottom Layer w0.254: v1(57.62,82.13) v1(59.63,81.86)
PA7_SPI1_MOSI_HC595_14_SER: length 22.5
  Top Layer w0.254: U32.14 64.86,85.31 64.35,84.8 62.83,84.8 v1(62.45,84.42) ; U6.13 52.19,78.04 51.4,78.83 51.4,79.84 51.65,80.1 52.71,80.1 ; v1(60.41,84.54) 60.41,83.78 56.73,80.1 52.71,80.1 ; 52.71,80.1 R14.1
  Bottom Layer w0.254: v1(62.45,84.42) 60.54,84.42 v1(60.41,84.54)
PA10_TIM1_SPWM: length 5.1
  Top Layer w0.254: U6.18 50.15,74.79 49.49,74.13 49.49,73.99 R22.2
PB1_4053_DANG_WEI: length 34
  Top Layer w0.254: 30.25,61.09 31.33,61.18 v1(34.12,65.88) ; 34.51,67.78 35.65,68.92 39.97,68.92 48.44,77.39 53.61,77.39
  Top Layer w0.5: U8.11 U8.10 U8.9
  Bottom Layer w0.254: v1(34.3,67.7) v1(34.12,65.88)
$1N2503: length 15.5
  Top Layer w0.3: Q6.2 14,64.54 14.95,65.49 17.75,65.49 R5.1
  Top Layer w0.5: R71.2 11.47,64.05
  Top Layer w0.7: R69.1 10.24,62.81 11.47,64.05 Q6.2
$1N3166: length 35.3
  Top Layer w0.3: R69.2 R3.1
  Top Layer w0.5: R7.1 7.11,73.69 R10.1 ; R8.2 17.1,73.51 R9.2
  Top Layer w1: 17.1,73.51 16.47,71.97 7.07,70.34 ; 7.07,70.34 7.11,73.69 ; 7.07,70.34 R69.2
$1N4522: length 42.3
  Top Layer w0.254: R71.1 5.29,60.17 3.64,61.81 3.64,63.33 5.42,65.11 12.66,65.11 14.44,66.89 17.62,66.89 R6.1
  Top Layer w0.5: Q7.2 11.36,59.22 ; 11.36,59.22 D12.2 C10.1 ; 11.36,59.22 R71.1
  Bottom Layer w1: D4.1 3.99,50.51 C10.1
$1N4539: length 5.3
  Top Layer w0.3: U8.1 R6.2
$1N5427: length 1.7
  Top Layer w0.5: R7.2 Q5.2
$1N5596: length 1.7
  Top Layer w0.5: R9.1 Q2.2
$1N5676: length 1.8
  Top Layer w0.5: R10.2 Q4.2
$1N5751: length 8.5
  Top Layer w0.5: D2.1 2.25,76.83 ; 2.25,76.83 R11.1 ; 2.25,76.83 Q4.1 4.41,78.19 6.44,78.19 Q5.1
$1N5765: length 8.8
  Top Layer w0.5: Q3.1 16.59,76.9 16,77.94 14.05,77.94 13.23,77.1 Q2.1 R12.2 D3.2
$1N6068: length 43.4
  Top Layer w0.5: D2.2 D3.1 ; U1.7 28.11,48.79 17.44,60.89 v1(17.49,61.68)
  Bottom Layer w0.5: D3.1 v1(17.49,61.68)
$1N6551: length 25.4
  Top Layer w0.5: R17.2 40.35,45.31 40.35,48.6 38.32,50.64 U1.6 39.71,51.27 v1(40.6,52.92) ; R13.1 v1(39.97,54.95)
  Bottom Layer w0.5: v1(39.97,54.95) v1(40.6,52.92)
$1N6884: length 19.6
  Top Layer w0.3: R15.2 37.05,53.3 U1.5
  Top Layer w0.5: R16.1 41.36,65.36 41.36,55.08 39.46,53.17 U1.5
$1N6914: length 5.9
  Top Layer w0.5: U1.13 U1.14 44.79,65.23 R16.2
$1N7022: length 5.8
  Top Layer w0.5: R13.2 37.94,64.11 U1.1 U1.2
$1N7167: length 6.6
  Top Layer w0.5: U1.9 U1.8 44.79,47.98 R17.1
$1N7251: length 9.1
  Top Layer w0.5: U1.10 C3.1 R18.2
$1N8310: length 3.6
  Top Layer w0.5: C7.2 51.99,54.31 ; 51.99,54.31 C3.2 ; 51.99,54.31 R19.1
$1N8402: length 3.3
  Top Layer w0.5: 51.99,57.37 R19.2 ; 51.99,57.37 C6.2 ; 51.99,57.37 R20.1
$1N8494: length 3.4
  Top Layer w0.5: 51.96,60.46 R20.2 ; 51.96,60.46 51.94,61.27 ; 51.96,60.46 C5.2
$1N8586: length 11.6
  Top Layer w0.254: R22.1 49.11,71.08 51.96,63.6
  Top Layer w0.5: R21.2 51.96,63.6 C4.2
$1N12567: length 4.2
  Top Layer w0.5: Q6.3 Q7.3
$1N13727: length 8.2
  Top Layer w0.3: v1(29.17,64.22) U8.13
  Top Layer w0.5: R24.2 28.41,57.63 v1(28.41,62.7)
  Bottom Layer w0.3: v1(28.41,62.7) v1(29.17,64.22)
$1N14310: length 19.2
  Top Layer w0.3: v1(29.17,65.49) U8.14
  Top Layer w0.5: Q6.1 15.9,62.94 ; 15.9,62.94 20.78,62.94 22.19,64.35 v1(23.08,64.35) ; 15.9,62.94 Q7.1
  Bottom Layer w0.3: v1(29.17,65.49) v1(23.08,64.35)
$1N14625: length 29.7
  Top Layer w0.5: U1.12 44.92,58.13 47.21,58.13 47.71,58.64 47.71,66.51 46.19,68.03 36.16,68.03 34.89,66.76 U8.15
$1N14690: length 26.3
  Top Layer w0.5: U1.3 32.35,58.25 29.55,55.46 24.47,55.46 20.79,59.14 20.79,60.67 24.34,64.22 U8.4
$1N15443: length 10.7
  Top Layer w0.3: U8.2 R5.2 U8.3
$1N15545: length 14.7
  Top Layer w0.3: R3.2 26,70.07 26.63,69.43 26.63,63.54 26.05,62.95 U8.5
$1N15824: length 8.6
  Top Layer w0.3: R23.2 28.28,69.04 28.28,63.92 29.25,62.95 U8.12
$1N18428: length 10.9
  Top Layer w2: C10.2 C11.2
  Bottom Layer w1: C11.2 D5.2 14.15,50.64 D4.2 12.44,50.51 C10.2
$1N18573: length 9.4
  Top Layer w2: C11.1 21.93,49.62 21.93,43.02
  Bottom Layer w1: C11.1 D5.1
$1N19610: length 4.2
  Bottom Layer w0.254: 88.23,45.05 88.1,44.92
  Bottom Layer w0.5: HP.1 91.28,44.54 C45.2
$1N19696: length 3.8
  Bottom Layer w0.5: C44.2 71.59,45.05 LP.1
$1N21004: length 10.9
  Top Layer w0.5: C45.1 R29.2 R30.1
$1N21176: length 11.4
  Top Layer w0.5: R31.1 72.09,49.24 R28.2 C44.1
$1N32014: length 1.9
  Top Layer w0.5: R33.1 52.15,96.86 NOREF#57.2
$1N33242: length 5
  Top Layer w0.254: 66.13,92.01 66.13,96.61 NOREF#39.7
$1N33289: length 5.3
  Top Layer w0.254: U32.3 64.86,95.85 NOREF#53.6
$1N33336: length 5.8
  Top Layer w0.254: NOREF#23.5 61.68,96.48 61.68,95.47 63.59,93.56 U32.4
$1N33383: length 6.4
  Top Layer w0.254: NOREF#16.4 58.89,96.86 62.32,93.43 U32.5
$1N33961: length 15.9
  Top Layer w0.5: NOREF#67.8 78.7,97.24 69.43,97.24 67.4,95.21 U32.1
$1N34010: length 25.2
  Top Layer w0.5: NOREF#25.10 82.51,95.21 69.94,95.21 69.43,94.7 69.43,90.77 66.13,87.47 66.13,86.47
$1N34377: length 9.5
  Top Layer w0.5: NOREF#11.11 86.07,95.21 83.4,94.32 R34.2
$1N38466: length 3.4
  Top Layer w0.254: U6.4 C14.1
$1N38585: length 1.5
  Top Layer w0.254: R35.1 U6.1
$1N39082: length 7.5
  Top Layer w0.254: U6.2 60.18,74.14 arc(60.86,74.01) 61.43,73.62 61.52,73.53 arc(61.69,73.28) C15.1
  Top Layer w0.5: C15.1 61.75,72.04 63.81,69.98 X1.1
$1N39137: length 11.9
  Top Layer w0.254: U6.3 60.47,74.79 arc(61.33,74.62) 62.06,74.13 63.46,74.13 arc(63.75,74.07) 64,73.91 64.92,72.99
  Top Layer w0.5: 64.92,72.99 64.92,72.29 67.91,69.3 X1.2
$1N41107: length 10
  Top Layer w0.254: U6.5 61.74,76.09 62.83,77.18 C17.2
  Top Layer w0.5: L1.1 66.13,78.7 64.6,78.45 C17.2
$1N43119: length 5.7
  Top Layer w0.5: R42.1 U2.2 U2.1
$1N43180: length 5.3
  Top Layer w0.5: U2.14 U2.13 R40.2
$1N44869: length 12.5
  Top Layer w0.5: C30.2 R38.2 R36.1 U2.7 U3.1 84.8,67.17 86.45,67.17
$1N45226: length 7.3
  Top Layer w0.5: R39.2 C30.1 R38.1 R36.2 U2.6
$1N46458: length 14
  Top Layer w0.5: R42.2 79.34,62.19 U2.9 R37.1
$1N46863: length 10.6
  Top Layer w0.5: R40.1 78.32,59.53 U2.10 R41.2
$1N47509: length 21.4
  Top Layer w0.5: 94,51.13 R30.2 85.69,54.7 U2.3 ; 94,51.13 D7.1 ; 94,51.13 D6.2
$1N53554: length 15.3
  Top Layer w0.254: U2.8 78.39,66.23 79.2,67.34 80.73,70.07 U3.3
  Top Layer w0.5: R37.2 U2.8 ; 86.45,70.73 84.93,70.73 U3.3
$1N53555: length 5.6
  Top Layer w0.5: U3.5 R46.1 R47.1 R48.2
$1N53825: length 32.7
  Top Layer w0.254: U11.7 89.24,85.43 88.23,83.91 85.31,82.64 82.26,82.51 82,82.39 81.24,81.37 80.35,77.31 79.72,72.22 79.21,71.84 78.7,71.72 U3.13
  Top Layer w0.5: U3.13 R50.2 R49.2 ; U11.7 R60.1 R59.2 C29.2
$1N53826: length 4.8
  Top Layer w0.5: U3.12 R50.1 R49.1 R51.2
$1N54675: length 5.6
  Top Layer w0.5: U3.2 R43.1 R44.1 R45.2
$1N57431: length 7.5
  Top Layer w0.5: R54.1 C28.1 R52.1 R53.2 U11.2
$1N60276: length 9
  Top Layer w0.5: C28.2 R52.2 R53.1 83.78,88.96 85.56,90 R62.1
$1N63379: length 16.9
  Top Layer w0.254: 70.62,86.12 70.81,86.14 ; 70.81,86.14 R56.2 C25.2 72.28,86.31 ; 70.81,86.14 72.28,86.31 ; 77.7,83.53 R54.2 ; 72.28,86.31 C24.1 73.75,86.07 74.13,85.69 74.13,83.78 v1(74.26,83.66)
  Top Layer w0.5: R57.2 79.25,83.53 v1(77.05,83.53)
  Bottom Layer w0.254: v1(77.05,83.53) 76.92,83.66 v1(74.26,83.66)
$1N64752: length 6.2
  Top Layer w0.5: C26.2 80.06,81.94 81.35,83.23 R57.1 83.52,84.13 83.78,83.88
$1N65001: length 4.9
  Top Layer w0.5: R58.2 93.56,81.34 U11.5 C27.2
$1N65468: length 7.4
  Top Layer w0.5: 91.4,83.88 R60.2 R59.1 C29.1 96.98,82.72
$1N66675: length 11.7
  Top Layer w0.254: U3.14 78.34,70.21 v1(79.08,70.95) ; C26.1 v1(78.96,72.61)
  Bottom Layer w0.254: v1(78.96,72.61) v1(79.08,70.95)
$1N66770: length 18.5
  Top Layer w0.254: C27.1 84.54,77.94 83.15,77.56 81.75,77.56 80.99,77.05 80.86,75.4 80.48,71.46 78.96,69.3 U3.15
$1N80254: length 8.3
  Top Layer w0.254: H5.2 52.92,69.18 52.16,69.18 51.27,70.07 51.27,73.24 52.17,74.14 U6.19
$1N80871: length 38.1
  Top Layer w0.254: SW2.1 54.57,47.35 54.57,48.86 56.48,50.76 56.48,63.97 55.08,65.37 55.08,75.15 54.78,75.44 U6.17
  Top Layer w1: SW2.2 SW2.1
$1N81993: length 42.4
  Top Layer w0.254: U6.12 56.23,78.69 57.49,77.43 57.49,50.51 59.65,48.35 59.65,46.79
  Top Layer w1: SW1.2 SW1.1
$1N91644: length 17.6
  Top Layer w0.254: v1(87.85,71.08) 90.26,70.45 C31.1 ; U3.4 v1(83.78,71.46)
  Bottom Layer w0.254: v1(83.78,71.46) v1(87.85,71.08)
$1N91645: length 11.4
  Top Layer w0.5: U2.5 R63.2 C31.2
$1N103941: length 18.8
  Top Layer w1: D1.1 25.36,88.1 L2.2 27.12,92.8 33.11,92.8 33.92,91.99 U5.2
$1N105414: length 21.8
  Top Layer w0.5: U5.5 28.54,86.07 25.49,84.29 22.19,84.29 21.3,84.54 20.79,86.45 19.9,88.73 19.39,90.39 18.76,92.04 R64.2 R65.2
$1N105671: length 2.4
  Top Layer w0.5: R65.1 C36.2
$1N151939: length 1.8
  Top Layer w0.5: R8.1 Q3.2
$1N174858: length 11.1
  Top Layer w0.5: D9.1 D8.2 R31.2 74,54.57 U2.12
$1N181368: length 4.1
  Top Layer w0.5: R2.2 R1.2 R34.1
$1N184453: length 2.2
  Top Layer w0.254: U6.20 53.61,71.89 H5.1

## Copper pours and planes (outline as drawn; the poured copper is in the pictures)
+5V-D on Top Layer: 2.09,87.21 9.74,87.21 9.74,78.85 2.09,78.85
-5V-D on Top Layer: 12.41,87.12 20.4,87.12 20.4,78.58 12.41,78.58
GND on Top Layer: 0,100 100.02,100 100.02,-0.06 0,-0.06
GND on Top Layer: -0.02,40.62 100.02,40.62 100.02,-0.06 -0.02,-0.06
GND on Top Layer: 54.95,78.19 56.99,78.19 56.99,73.24 54.95,73.24
GND on Bottom Layer: 0,100 100,100 100,0 0,0

## Text on the board
Bottom Silkscreen Layer: LC | HC | LP | HP | 电池内阻测试仪yjmwxwx-2023-03-16 | 莱州尹辑明设计
Top Silkscreen Layer: LC | HC | LP | HP
